# Altium schematic sheet BeagleBone_RF_Cape_Rev A2_EMInf.SchDoc: ChangeMe
size A4; Date: Not shown in title block; ApprovedBy: Not shown in title block; CheckedBy: Not shown in title block; Author: Not shown in title block; CompanyName: Not shown in title block; DrawnBy: Not shown in title block; Engineer: Not shown in title block; Organization: Not shown in title block; Address1: Not shown in title block; Address2: Not shown in title block; Address3: Not shown in title block; Address4: Not shown in title block; DocumentNumber: 3; Revision: 0.1; SheetNumber: 3; SheetTotal: 3; CurrentTime: Not shown in title block; CurrentDate: Not shown in title block; Time: Not shown in title block; DocumentFullPathAndName: Not shown in title block; DocumentName: Not shown in title block; ModifiedDate: Not shown in title block; ImagePath: Not shown in title block; ProjectName: RF Adaptor Cape
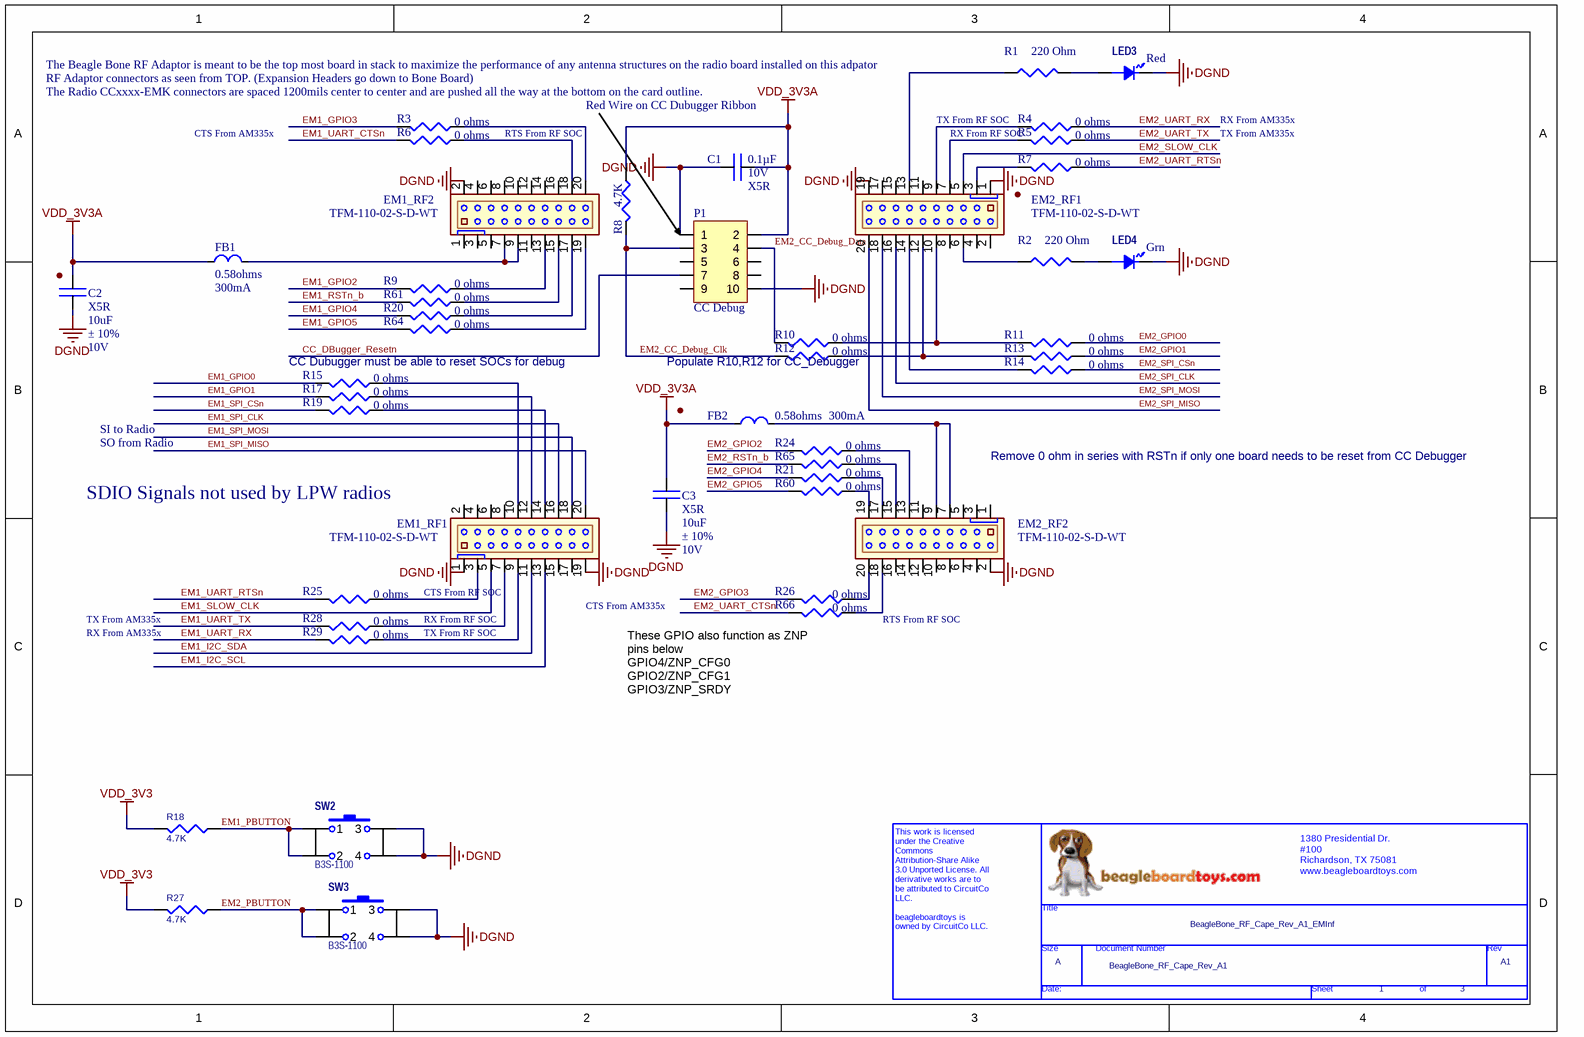
[diagram p0: BeagleBone_RF_Cape_Rev A2_EMInf.SchDoc]

## Parts
*?  Page Count: 3  Page Number: 1  Page Size: A  Title: BeagleBone_RF_Cape_Rev_A1_EMInf  RevCode: A1  Doc: BeagleBone_RF_Cape_Rev_A1  (hidden comment: BBT_OPENSOURCE)  (graphical)
C1  Capacitance: 0.1µF  Voltage - Rated: 10V  Temperature Coefficient: X5R  [CC0402]  (hidden comment: 10% X5R 0402)
C2  Dielectric Characteristic: X5R  Capacitance: 10uF  Capacitance Tolerance: ± 10%  Voltage Rating: 10V  [CC0805]  (hidden comment: 10V, X5R, 0805)
C3  Dielectric Characteristic: X5R  Capacitance: 10uF  Capacitance Tolerance: ± 10%  Voltage Rating: 10V  [CC0805]  (hidden comment: 10V, X5R, 0805)
EM1_RF1  20POS 1.27MM GLD SMD  [TFM-110-02-X-D-A]  (value not drawn)
EM1_RF2  20POS 1.27MM GLD SMD  [TFM-110-02-X-D-A]  (value not drawn)
EM2_RF1  20POS 1.27MM GLD SMD  [TFM-110-02-X-D-A]  (value not drawn)
EM2_RF2  20POS 1.27MM GLD SMD  [TFM-110-02-X-D-A]  (value not drawn)
FB1  DC Resistance Max: 0.58ohms  DC Current Rating: 300mA  [SMT IND 0402]  (hidden comment: 0402, 580mOHM, 300mA)
FB2  DC Resistance Max: 0.58ohms  DC Current Rating: 300mA  [SMT IND 0402]  (hidden comment: 0402, 580mOHM, 300mA)
LED3  Red  [LED-0603]  (value not drawn)
LED4  Grn  [LED-0603]  (value not drawn)
P1  CC Debug  [HEADER10P]
R1  Resistance (Ohms): 220 Ohm  [RESC0402]  (hidden comment: 1/10W 1% 0402 SMD)
R2  Resistance (Ohms): 220 Ohm  [RESC0402]  (hidden comment: 1/10W 1% 0402 SMD)
R3  Resistance (Ohms): 0 ohms  [RESC0402]  (hidden comment: 0402 Chip Res 5%)
R4  Resistance (Ohms): 0 ohms  [RESC0402]  (hidden comment: 0402 Chip Res 5%)
R5  Resistance (Ohms): 0 ohms  [RESC0402]  (hidden comment: 0402 Chip Res 5%)
R6  Resistance (Ohms): 0 ohms  [RESC0402]  (hidden comment: 0402 Chip Res 5%)
R7  Resistance (Ohms): 0 ohms  [RESC0402]  (hidden comment: 0402 Chip Res 5%)
R8  Resistance (Ohms): 4.7K  [RESC0402]  (hidden comment: 1/10W 1% 0402 SMD)
R9  Resistance (Ohms): 0 ohms  [RESC0402]  (hidden comment: 0402 Chip Res 5%)
R10  Resistance (Ohms): 0 ohms  [RESC0402]  (hidden comment: 0402 Chip Res 5%)
R11  Resistance (Ohms): 0 ohms  [RESC0402]  (hidden comment: 0402 Chip Res 5%)
R12  Resistance (Ohms): 0 ohms  [RESC0402]  (hidden comment: 0402 Chip Res 5%)
R13  Resistance (Ohms): 0 ohms  [RESC0402]  (hidden comment: 0402 Chip Res 5%)
R14  Resistance (Ohms): 0 ohms  [RESC0402]  (hidden comment: 0402 Chip Res 5%)
R15  Resistance (Ohms): 0 ohms  [RESC0402]  (hidden comment: 0402 Chip Res 5%)
R17  Resistance (Ohms): 0 ohms  [RESC0402]  (hidden comment: 0402 Chip Res 5%)
R18  Resistance (Ohms): 4.7K  [RESC0402]  (hidden comment: 1/10W 1% 0402 SMD)
R19  Resistance (Ohms): 0 ohms  [RESC0402]  (hidden comment: 0402 Chip Res 5%)
R20  Resistance (Ohms): 0 ohms  [RESC0402]  (hidden comment: 0402 Chip Res 5%)
R21  Resistance (Ohms): 0 ohms  [RESC0402]  (hidden comment: 0402 Chip Res 5%)
R24  Resistance (Ohms): 0 ohms  [RESC0402]  (hidden comment: 0402 Chip Res 5%)
R25  Resistance (Ohms): 0 ohms  [RESC0402]  (hidden comment: 0402 Chip Res 5%)
R26  Resistance (Ohms): 0 ohms  [RESC0402]  (hidden comment: 0402 Chip Res 5%)
R27  Resistance (Ohms): 4.7K  [RESC0402]  (hidden comment: 1/10W 1% 0402 SMD)
R28  Resistance (Ohms): 0 ohms  [RESC0402]  (hidden comment: 0402 Chip Res 5%)
R29  Resistance (Ohms): 0 ohms  [RESC0402]  (hidden comment: 0402 Chip Res 5%)
R60  Resistance (Ohms): 0 ohms  [RESC0402]  (hidden comment: 0402 Chip Res 5%)
R61  Resistance (Ohms): 0 ohms  [RESC0402]  (hidden comment: 0402 Chip Res 5%)
R64  Resistance (Ohms): 0 ohms  [RESC0402]  (hidden comment: 0402 Chip Res 5%)
R65  Resistance (Ohms): 0 ohms  [RESC0402]  (hidden comment: 0402 Chip Res 5%)
R66  Resistance (Ohms): 0 ohms  [RESC0402]  (hidden comment: 0402 Chip Res 5%)
SW2  B3S-1100  [SWITCH-OMRON-B3S-1000]
SW3  B3S-1100  [SWITCH-OMRON-B3S-1000]

## Nets
DGND: C1.1 C2.2 C3.2 EM1_RF1.1 EM1_RF1.19 EM1_RF2.2 EM2_RF1.1 EM2_RF1.19 EM2_RF2.2 LED3.K(CATHODE) LED4.K(CATHODE) P1.1 P1.10 SW2.3 SW2.4 SW3.3 SW3.4
VDD_3V3: R18.2 R27.2
VDD_3V3A: C1.2 C2.1 C3.1 FB1.2 FB2.2 P1.2 R8.1
CC_DBugger_Resetn: P1.7
EM1_GPIO0: R15.2
EM1_GPIO1: R17.2
EM1_GPIO2: R9.2
EM1_GPIO3: R3.2
EM1_GPIO4: R20.2
EM1_GPIO5: R64.2
EM1_I2C_SCL: EM1_RF1.13
EM1_I2C_SDA: EM1_RF1.11
EM1_PBUTTON: R18.1 SW2.1 SW2.2
EM1_RSTn_b: R61.2
EM1_SLOW_CLK: EM1_RF1.5
EM1_SPI_CLK: EM1_RF1.16
EM1_SPI_CSn: R19.2
EM1_SPI_MISO: EM1_RF1.20
EM1_SPI_MOSI: EM1_RF1.18
EM1_UART_CTSn: R6.2
EM1_UART_RTSn: R25.2
EM1_UART_RX: R29.2
EM1_UART_TX: R28.2
EM2_CC_Debug_Clk: P1.3 R8.2 R12.2
EM2_CC_Debug_Data: P1.4 R10.2
EM2_GPIO0: R11.1
EM2_GPIO1: R13.1
EM2_GPIO2: R24.2
EM2_GPIO3: R26.2
EM2_GPIO4: R21.2
EM2_GPIO5: R60.2
EM2_PBUTTON: R27.1 SW3.1 SW3.2
EM2_RSTn_b: R65.2
EM2_SLOW_CLK: EM2_RF1.5
EM2_SPI_CLK: EM2_RF1.16
EM2_SPI_CSn: R14.1
EM2_SPI_MISO: EM2_RF1.20
EM2_SPI_MOSI: EM2_RF1.18
EM2_UART_CTSn: R66.2
EM2_UART_RTSn: R7.1
EM2_UART_RX: R4.1
EM2_UART_TX: R5.1
NetEM1_RF1_3: EM1_RF1.3 R25.1
NetEM1_RF1_7: EM1_RF1.7 R28.1
NetEM1_RF1_9: EM1_RF1.9 R29.1
NetEM1_RF1_10: EM1_RF1.10 R15.1
NetEM1_RF1_12: EM1_RF1.12 R17.1
NetEM1_RF1_14: EM1_RF1.14 R19.1
NetEM1_RF2_7: EM1_RF2.7 EM1_RF2.9 FB1.1
NetEM1_RF2_13: EM1_RF2.13 R9.1
NetEM1_RF2_15: EM1_RF2.15 R61.1
NetEM1_RF2_17: EM1_RF2.17 R20.1
NetEM1_RF2_18: EM1_RF2.18 R6.1
NetEM1_RF2_19: EM1_RF2.19 R64.1
NetEM1_RF2_20: EM1_RF2.20 R3.1
NetEM2_RF1_3: EM2_RF1.3 R7.2
NetEM2_RF1_6: EM2_RF1.6 R2.1
NetEM2_RF1_7: EM2_RF1.7 R5.2
NetEM2_RF1_9: EM2_RF1.9 R4.2
NetEM2_RF1_10: EM2_RF1.10 R10.1 R11.2
NetEM2_RF1_12: EM2_RF1.12 R12.1 R13.2
NetEM2_RF1_13: EM2_RF1.13 R1.1
NetEM2_RF1_14: EM2_RF1.14 R14.2
NetEM2_RF2_7: EM2_RF2.7 EM2_RF2.9 FB2.1
NetEM2_RF2_13: EM2_RF2.13 R24.1
NetEM2_RF2_15: EM2_RF2.15 R65.1
NetEM2_RF2_17: EM2_RF2.17 R21.1
NetEM2_RF2_18: EM2_RF2.18 R66.1
NetEM2_RF2_19: EM2_RF2.19 R60.1
NetEM2_RF2_20: EM2_RF2.20 R26.1
NetLED3_A: LED3.A(ANODE) R1.2
NetLED4_A: LED4.A(ANODE) R2.2

Not connected (* = marked no-connect by the designer): EM1_RF1 2 4 6 8 15 17; EM1_RF2 1 3 4 5 6 8 10 11 12 14 16; EM2_RF1 2 4 8 11 15 17; EM2_RF2 1 3 4 5 6 8 10 11 12 14 16; P1 5 6 8 9

## Notes on the sheet
- (near R1) The Beagle Bone RF Adaptor is meant to be the top most board in stack to maximize the performance of any antenna structures on the radio board installed on this adpator
- The Radio CCxxxx-EMK connectors are spaced 1200mils center to center and are pushed all the way at the bottom on the card outline.
- RF Adaptor connectors as seen from TOP. (Expansion Headers go down to Bone Board)
- Red Wire on CC Dubugger Ribbon
- CTS From AM335x
- RTS From RF SOC
- TX From RF SOC
- RX From RF SOC
- TX From AM335x
- RX From AM335x
- (near R15) CC Dubugger must be able to reset SOCs for debug
- (near R12) Populate R10,R12 for CC_Debugger
- SO from Radio
- SI to Radio
- (near EM1_RF1) SDIO Signals not used by LPW radios
- Remove 0 ohm in series with RSTn if only one board needs to be reset from CC Debugger
- (near EM1_RF1) CTS From RF SOC
- (near EM1_RF1) CTS From AM335x
- (near R66) These GPIO also function as ZNP pins below
  GPIO4/ZNP_CFG0
  GPIO2/ZNP_CFG1
  GPIO3/ZNP_SRDY
- (in symbol BBT_OPENSOURCE) 1380 Presidential Dr. / #100 / Richardson, TX 75081 / www.beagleboardtoys.com /; Title; Size; Document Number; Rev; Date:; Sheet; of; This work is licensed / under the Creative / Commons / Attribution-Share Alike / 3.0 Unported License. All / derivative works are to / be attributed to CircuitCo / LLC. / beagleboardtoys is / owned by CircuitCo LLC. /

## Library data of the parts
*? = BBT_OPENSOURCE: OrgName: BBT; Page Create Date: July 16 2012
C1 = LMK105BJ104KV-F: CAP CER 0.1UF 10V 10% X5R 0402; Manufacturer: Taiyo Yuden; Supplier 1: Digi-Key; RoHS: RoHS Compliant; Category: Capacitors; Stock 1: 3218784; Pricing 1: 1=0.04, 10=0.025, 50=0.012, 100=0.009, 250=0.00652, 500=0.0048, 1000=0.00325, 5000=0.0025 (USD); Tolerance: ±10%; Mounting Type: Surface Mount, MLCC; Operating Temperature: -55°C ~ 85°C; Applications: General Purpose; Ratings: -; Package / Case: 0402 (1005 Metric); Size / Dimension: 0.039" L x 0.020" W (1.00mm x 0.50mm); Height - Seated (Max): -; Thickness (Max): 0.022" (0.55mm); Lead Spacing: -; Features: -; Packaging: Digi-Reel®; Lead Style: -; ComponentLink1URL: http://www.yuden.co.jp/productdata/catalog/en/mlcc01_e.pdf; ComponentLink1Description: http://www.yuden.co.jp/productdata/catalog/en/mlcc01_e.pdf; Supplier Part Number 1: 587-1227-6-ND; Manufacturer Part Number: LMK105BJ104KV-F
C2 C3 = C0805C106K8PACTU: CAP CER10UF, 10V, X5R, 0805; Manufacturer: KEMET; Description: KEMET - C0805C106K8PACTU - CAPACITOR CERAMIC, 10UF, 10V, X5R, 0805; Capacitor Case Style: 0805; Capacitor Mounting: SMD; Supplier 1: Newark; RoHS: YES; Stock 1: 144494; Pricing 1: 1=0.25, 10=0.25, 100=0.24, 500=0.234, 1000=0.2, 2500=0.183, 5000=0.162, 10000=0.157 (USD); Operating Temperature Range: -55°C to +85; ComponentLink1URL: http://www.kemet.com/kemet/web/homepage/kechome.nsf/file/Commercial Ceramic Chips X5R Dielectric/$file/KEM_C1006_X5R_SMD.pdf; ComponentLink1Description: http://www.kemet.com/kemet/web/homepage/kechome.nsf/file/Commercial Ceramic Chips X5R Dielectric/$file/KEM_C1006_X5R_SMD.pdf; ComponentLink2URL: http://www.farnell.com/cad/1455916.zip; ComponentLink2Description: http://www.farnell.com/cad/1455916.zip; ComponentLink3URL: http://www.semtech.com.hk/Transistor/Packing/Tape%20and%20Reel%20Specifications%20and%20Packaging%20Specifications.pdf; ComponentLink3Description: http://www.semtech.com.hk/Transistor/Packing/Tape%20and%20Reel%20Specifications%20and%20Packaging%20Specifications.pdf; ComponentLink4URL: http://www.kemet.com/kemet/web/homepage/kechome.nsf/file/Commercial%20Ceramic%20Chips%20X5R%20Dielectric/$file/F3102_X5R.pdf; ComponentLink4Description: http://www.kemet.com/kemet/web/homepage/kechome.nsf/file/Commercial%20Ceramic%20Chips%20X5R%20Dielectric/$file/F3102_X5R.pdf; Supplier Part Number 1: 70K9138; Manufacturer Part Number: C0805C106K8PACTU
EM1_RF1 EM1_RF2 EM2_RF1 EM2_RF2 = TFM-110-02-S-D-WT: CONN HEADER 20POS 1.27MM GLD SMD; Manufacturer: Samtec Inc; Connector Type: Receptacle; Number of Positions: 20; Number of Positions Loaded: All; Pitch: 0.050" (1.27mm); Supplier 1: Digi-Key; RoHS: RoHS Compliant; Category: Connectors, Interconnects; Stock 1: 353; Pricing 1: 1=5.56, 10=4.708, 25=4.494, 50=4.066, 100=3.638, 250=3.21, 500=2.996, 1000=2.782, 2500=2.675 (USD); Contact Type: Male Pin; Number of Rows: 2; Row Spacing: 0.050" (1.27mm); Contact Mating Length: -; Mounting Type: Surface Mount; Termination: Solder; Fastening Type: -; Features: Solder Retention; Contact Finish: Gold; Contact Finish Thickness: 30µin (0.76µm); Color: Black; Packaging: Tube; ComponentLink1URL: http://www.samtec.com/ftppub/cpdf/TFM-1XX-XX-XXX-X-XXX.PDF; ComponentLink1Description: http://www.samtec.com/ftppub/cpdf/TFM-1XX-XX-XXX-X-XXX.PDF; Supplier Part Number 1: SAM8705-ND; Manufacturer Part Number: TFM-110-02-S-D-WT
FB1 FB2 = BK1005HS102-T: FERRITE BEAD, 0402, 580mOHM, 300mA; Manufacturer: TAIYO YUDEN; Description: TAIYO YUDEN - BK1005HS102-T - FERRITE BEAD, 0402, 580mOHM, 300mA; Impedance: 1; Ferrite Grade: HS; Ferrite Mounting: SMD; Ferrite Case Style: 0402 / 1005; Supplier 1: Newark; RoHS: YES; Stock 1: 9870; Pricing 1: 1=0.328, 10=0.219, 50=0.113, 100=0.088, 250=0.063, 500=0.045, 1000=0.033, 4000=0.024 (USD); Series: LF BK; ComponentLink1URL: http://www.yuden.co.jp/ut/product/category/emisuppression/BK1005HS102-T.pdf; ComponentLink1Description: http://www.yuden.co.jp/ut/product/category/emisuppression/BK1005HS102-T.pdf; ComponentLink2URL: http://www.yuden.co.jp/us/product/pdf_html/pdf/E)Chip%20Beads.pdf; ComponentLink2Description: http://www.yuden.co.jp/us/product/pdf_html/pdf/E)Chip%20Beads.pdf; Supplier Part Number 1: 87K3443; Manufacturer Part Number: BK1005HS102-T
LED3 = LED-RED-0603: SMT LED 0603; Mfg. Part Number: LNJ312G8LRA; Desc.: LED RED 0603; Mfg.: Panasonic; Supplier 1: Digi-Key; Supplier Part Number 1: P11466TR-ND
LED4 = LED-GRN-0603: SMT LED 0603; Mfg. Part Number: LNJ312G8LRA; Desc.: LED GRN 0603; Mfg.: Panasonic; Supplier 1: Digi-Key; Supplier Part Number 1: P11473TR-ND
P1 = SMT Header 5x2: SMT Header, 10-Pin, .050LS Dual row; Mfg. Part Number: GRPB052VWQS-RC; Manufacturer: Sullins Connector Solutions; Desc.: SMT Header .050 Lead spacing SMT; Mfg.: Sullins; Description: CONN HEADER .050" 10PS DL SMD AU; Connector Type: Header, Unshrouded; Number of Positions: 10; Number of Positions Loaded: All; Pitch: 0.050" (1.27mm); Supplier 1: Digi-Key; Supplier Part Number 1: S9012E-05-ND; RoHS: RoHS Compliant; Category: Connectors, Interconnects; Stock 1: 4993; Pricing 1: 1=1.08, 10=0.899, 50=0.7492, 100=0.666, 250=0.58276, 500=0.5328, 1000=0.48285, 2500=0.4329, 5000=0.42458 (USD); Contact Type: Male Pin; Number of Rows: 2; Row Spacing: 0.050" (1.27mm); Contact Mating Length: 0.118" (3.00mm); Mounting Type: Surface Mount; Termination: Solder; Fastening Type: -; Features: -; Contact Finish: Gold; Contact Finish Thickness: Flash; Color: -; Packaging: Bulk; ComponentLink1URL: http://media.digikey.com/pdf/Data%20Sheets/Sullins%20PDFs/GRPB_%20_2VWQS-RC%2010958-C.pdf; ComponentLink1Description: http://media.digikey.com/pdf/Data%20Sheets/Sullins%20PDFs/GRPB_%20_2VWQS-RC%2010958-C.pdf; Manufacturer Part Number: GRPB052VWQS-RC
R1 R2 = ERJ-2GEJ221X: RES 220 OHM 1/10W 1% 0402 SMD; Manufacturer: Panasonic - ECG; Power (Watts): 0.1W, 1/10W; Temperature Coefficient: ±100ppm/°C; RoHS: RoHS Compliant; Category: Resistors; Composition: Thick Film; Features: -; Tolerance: ±1%; Size / Dimension: 0.039" L x 0.020" W (1.00mm x 0.50mm); Height: 0.016" (0.40mm); Number of Terminations: 2; Packaging: Cut Tape (CT); Package / Case: 0402 (1005 Metric); ComponentLink1URL: http://industrial.panasonic.com/www-cgi/jvcr13pz.cgi?E+PZ+3+AOA0002+ERJ2RKF1501X+7+WW; ComponentLink1Description: http://industrial.panasonic.com/www-cgi/jvcr13pz.cgi?E+PZ+3+AOA0002+ERJ2RKF1501X+7+WW; Manufacturer Part Number: ERJ-2GEJ221X; Supplier 1: Digi-Key; Supplier Part Number 1: P220JCT-ND
R3-R7 R9-R15 R17 R19-R21 R24-R26 R28 R29 R60 R61 R64-R66 = ERJ-2GE0R00X: RES 0.0 OHM 1/10W 0402 SMD; Manufacturer: Panasonic - ECG; Power (Watts): 0.1W, 1/10W; Tolerance: Jumper; Manufacturer Part Number: ERJ-2GE0R00X; Supplier 1: Digi-Key; RoHS: RoHS Compliant; Category: Resistors; Stock 1: 6266946; Pricing 1: 1=0.05, 50=0.0172, 100=0.0131, 250=0.00976, 500=0.0072, 1000=0.0048, 5000=0.00338 (USD); Composition: Thick Film; Features: -; Temperature Coefficient: -; Size / Dimension: 0.039" L x 0.020" W (1.00mm x 0.50mm); Height: 0.016" (0.40mm); Number of Terminations: 2; Packaging: Digi-Reel®; Package / Case: 0402 (1005 Metric); ComponentLink1URL: http://industrial.panasonic.com/www-cgi/jvcr13pz.cgi?E+PZ+3+AOA0001+ERJ2GE0R00X+7+WW; ComponentLink1Description: http://industrial.panasonic.com/www-cgi/jvcr13pz.cgi?E+PZ+3+AOA0001+ERJ2GE0R00X+7+WW; Supplier Part Number 1: P0.0JDKR-ND
R8 R18 R27 = ERJ-2RKF4701X: RES 4.70K OHM 1/10W 1% 0402 SMD; Manufacturer: Panasonic - ECG; Power (Watts): 0.1W, 1/10W; Temperature Coefficient: ±100ppm/°C; Supplier 1: Digi-Key; RoHS: RoHS Compliant; Category: Resistors; Stock 1: 1996806; Pricing 1: 1=0.06, 50=0.0242, 100=0.0184, 250=0.01364, 500=0.01008, 1000=0.00672, 5000=0.00473 (USD); Composition: Thick Film; Features: -; Tolerance: ±1%; Size / Dimension: 0.039" L x 0.020" W (1.00mm x 0.50mm); Height: 0.016" (0.40mm); Number of Terminations: 2; Packaging: Cut Tape (CT); Package / Case: 0402 (1005 Metric); ComponentLink1URL: http://industrial.panasonic.com/www-cgi/jvcr13pz.cgi?E+PZ+3+AOA0002+ERJ2RKF4701X+7+WW; ComponentLink1Description: http://industrial.panasonic.com/www-cgi/jvcr13pz.cgi?E+PZ+3+AOA0002+ERJ2RKF4701X+7+WW; Supplier Part Number 1: P4.70KLCT-ND; Manufacturer Part Number: ERJ-2RKF4701X
SW2 SW3 = SW-PB: Switch, Tact 6mm SMT; Part Field 1: SW-TACT-6MM; Manufacturer: Omron; Part Number: B3S-1000; Supplier 1: Digi-Key; Supplier Part Number 1: SW844TR-ND